# EAGLE design BpodMainBoard_r0_5_1 (EAGLE 9.1.1)
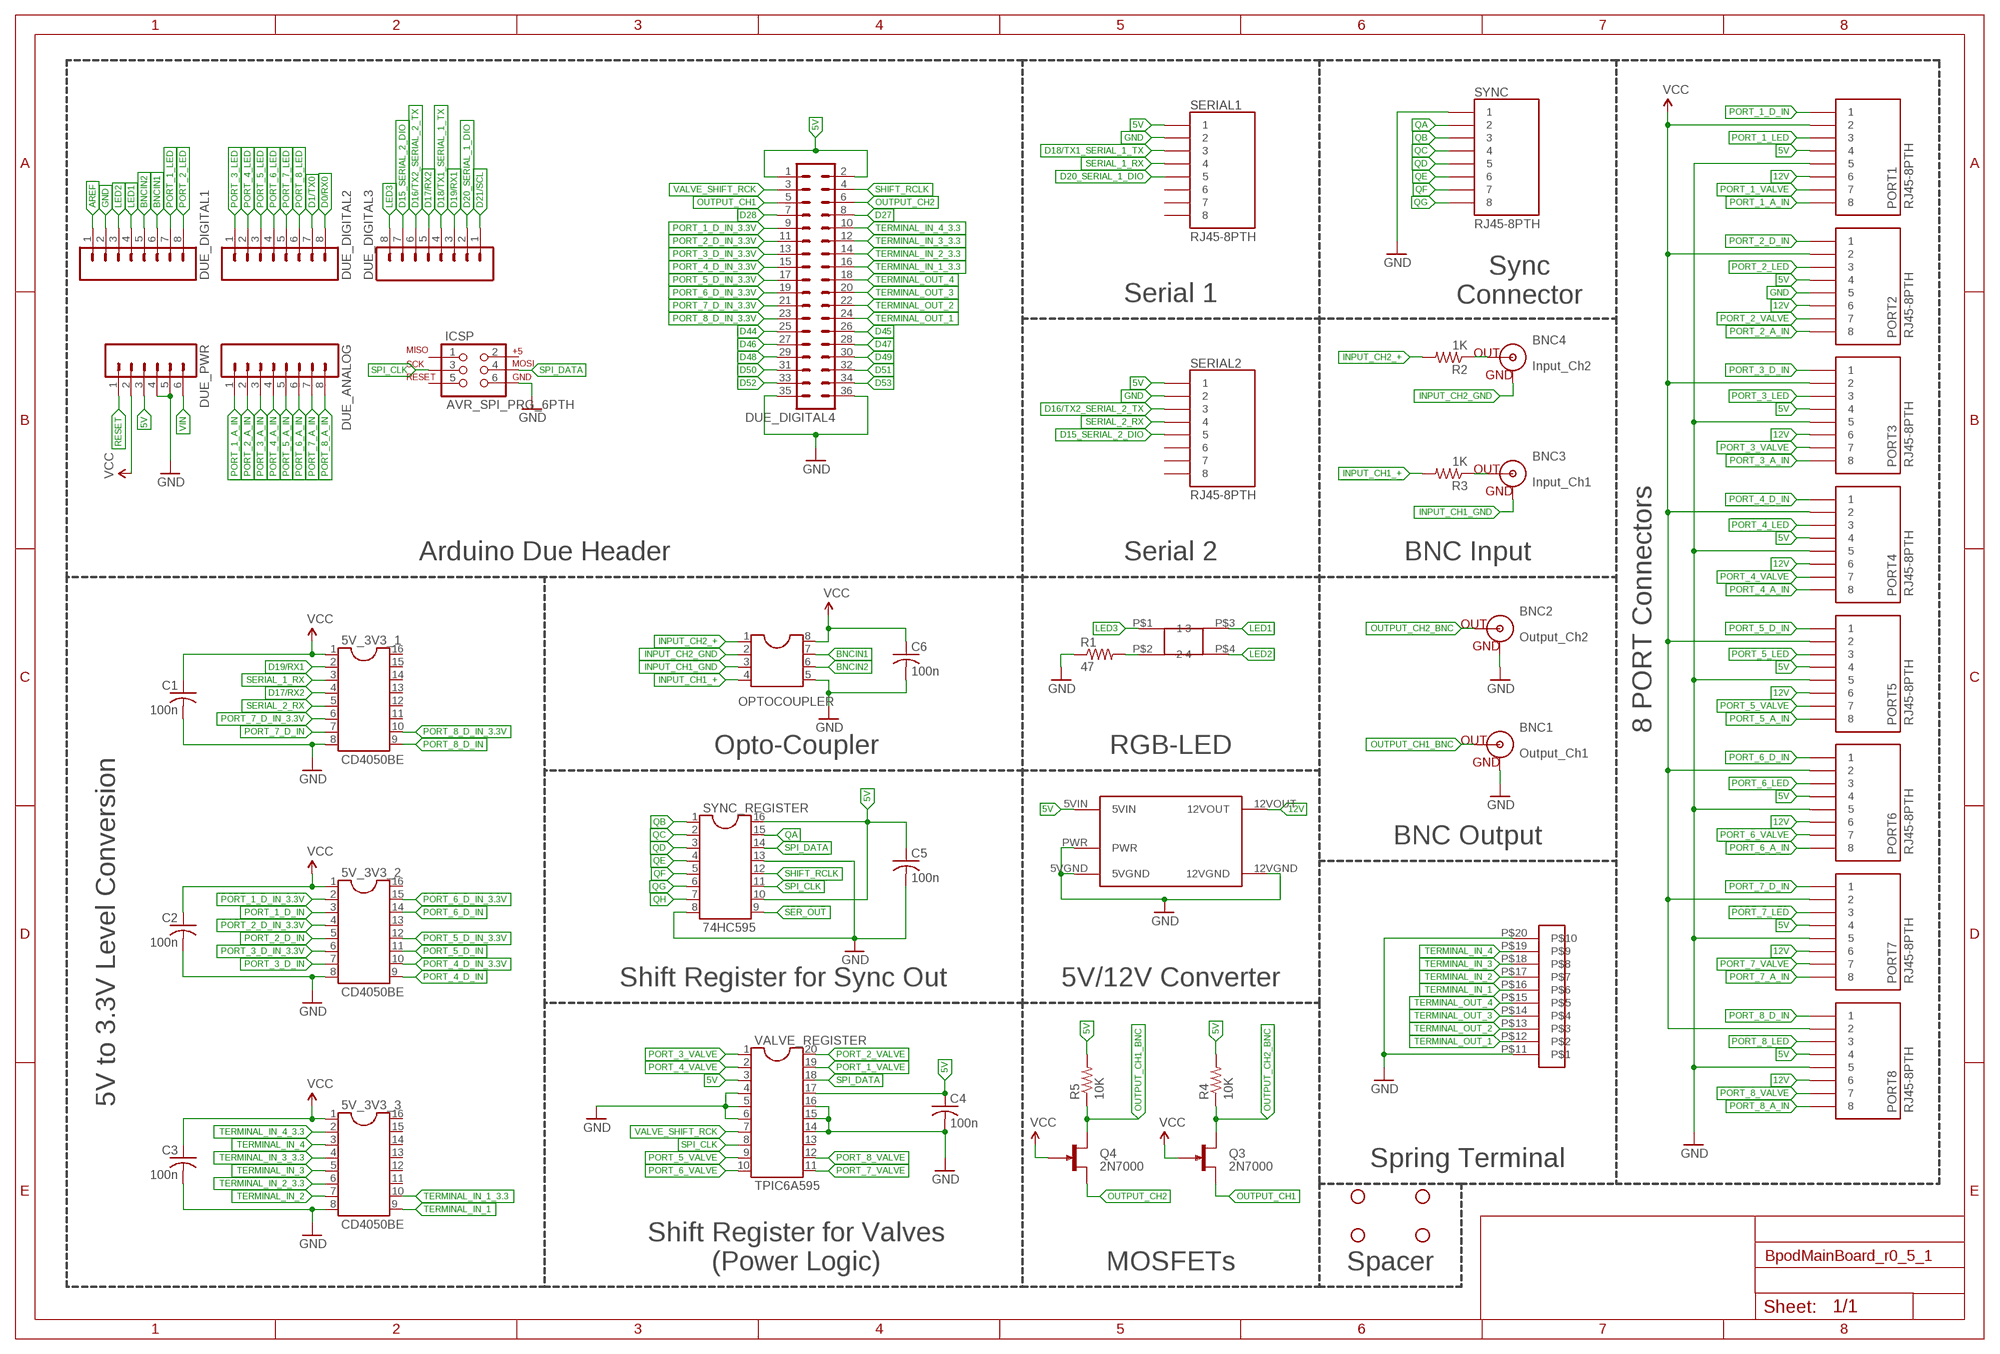
[diagram p0: schematic, sheet 1]

## Parts
5V_3V3_1  CD4050BE  DIL16  [DIL16]
5V_3V3_2  CD4050BE  DIL16  [DIL16]
5V_3V3_3  CD4050BE  DIL16  [DIL16]
BNC1  Output_Ch1  BNCPTH  [BNC]
BNC2  Output_Ch2  BNCPTH  [BNC]
BNC3  Input_Ch1  BNCPTH  [BNC]
BNC4  Input_Ch2  BNCPTH  [BNC]
C1  100n  C-US025-024X044  [C025-024X044]
C2  100n  C-US025-024X044  [C025-024X044]
C3  100n  C-US025-024X044  [C025-024X044]
C4  100n  C-US025-024X044  [C025-024X044]
C5  100n  C-US025-024X044  [C025-024X044]
C6  100n  C-US025-024X044  [C025-024X044]
DUE_ANALOG  M081X08  [1X08]
DUE_DIGITAL1  M081X08  [1X08]
DUE_DIGITAL2  M081X08  [1X08]
DUE_DIGITAL3  M081X08  [1X08]
DUE_DIGITAL4  MA18-2  [MA18-2]
DUE_PWR  M06SIP  [1X06]
ICSP  AVR_SPI_PRG_6PTH  [2X3]
JP1  STAND-OFF  [STAND-OFF]
JP2  STAND-OFF  [STAND-OFF]
JP3  STAND-OFF  [STAND-OFF]
JP4  STAND-OFF  [STAND-OFF]
OPTOCOUPLER  DIL8  [DIL08]
PORT1  RJ45-8PTH  [RJ45-8]
PORT2  RJ45-8PTH  [RJ45-8]
PORT3  RJ45-8PTH  [RJ45-8]
PORT4  RJ45-8PTH  [RJ45-8]
PORT5  RJ45-8PTH  [RJ45-8]
PORT6  RJ45-8PTH  [RJ45-8]
PORT7  RJ45-8PTH  [RJ45-8]
PORT8  RJ45-8PTH  [RJ45-8]
Q3  2N7000  2N3819  [TO92F]
Q4  2N7000  2N3819  [TO92F]
R1  47  R-US_0207/10  [0207/10]
R2  1K  R-US_0207/10  [0207/10]
R3  1K  R-US_0207/10  [0207/10]
R4  10K  R-US_0207/10  [0207/10]
R5  10K  R-US_0207/10  [0207/10]
SERIAL1  RJ45-8PTH  [RJ45-8]
SERIAL2  RJ45-8PTH  [RJ45-8]
SPRINGTERMINAL  10POS_SPRING_TERMINAL  [10POS_SCREW_TERMINAL]
SYNC  RJ45-8PTH  [RJ45-8]
SYNC_REGISTER  74HC595  DIL16  [DIL16]
U$5  TDK_LAMBDA_5V_TO_12V  [TDK_LAMBDA_5V_12V]
U$8  SQUARE_TRICOLOR_LED  [SQUARE_TRICOLOR_LED]
VALVE_REGISTER  TPIC6A595  DIL20  [DIL20]

## Nets
5V: C4.1 C5.1 DUE_DIGITAL4.1 DUE_DIGITAL4.2 DUE_PWR.3 PORT1.4 PORT2.4 PORT3.4 PORT4.4 PORT5.4 PORT6.4 PORT7.4 PORT8.4 R4.2 R5.2 SERIAL1.1 SERIAL2.1 SYNC_REGISTER.10 SYNC_REGISTER.16 U$5.5VIN VALVE_REGISTER.3 VALVE_REGISTER.17
12V: PORT1.6 PORT2.6 PORT3.6 PORT4.6 PORT5.6 PORT6.6 PORT7.6 PORT8.6 U$5.12VOUT
AREF: DUE_DIGITAL1.1
BNCIN1: DUE_DIGITAL1.6 OPTOCOUPLER.7
BNCIN2: DUE_DIGITAL1.5 OPTOCOUPLER.6
D0/RX0: DUE_DIGITAL2.8
D1/TX0: DUE_DIGITAL2.7
D15_SERIAL_2_DIO: DUE_DIGITAL3.7 SERIAL2.5
D16/TX2_SERIAL_2_TX: DUE_DIGITAL3.6 SERIAL2.3
D17/RX2: 5V_3V3_1.4 DUE_DIGITAL3.5
D18/TX1_SERIAL_1_TX: DUE_DIGITAL3.4 SERIAL1.3
D19/RX1: 5V_3V3_1.2 DUE_DIGITAL3.3
D20_SERIAL_1_DIO: DUE_DIGITAL3.2 SERIAL1.5
D21/SCL: DUE_DIGITAL3.1
D27: DUE_DIGITAL4.8
D28: DUE_DIGITAL4.7
D44: DUE_DIGITAL4.25
D45: DUE_DIGITAL4.26
D46: DUE_DIGITAL4.27
D47: DUE_DIGITAL4.28
D48: DUE_DIGITAL4.29
D49: DUE_DIGITAL4.30
D50: DUE_DIGITAL4.31
D51: DUE_DIGITAL4.32
D52: DUE_DIGITAL4.33
D53: DUE_DIGITAL4.34
GND: 5V_3V3_1.8 5V_3V3_2.8 5V_3V3_3.8 BNC1.GND BNC2.GND C1.2 C2.2 C3.2 C4.2 C5.2 C6.2 DUE_DIGITAL1.2 DUE_DIGITAL4.35 DUE_DIGITAL4.36 DUE_PWR.4 DUE_PWR.5 ICSP.6 OPTOCOUPLER.5 PORT1.5 PORT2.5 PORT3.5 PORT4.5 PORT5.5 PORT6.5 PORT7.5 PORT8.5 R1.1 SERIAL1.2 SERIAL2.2 SPRINGTERMINAL.P$11 SPRINGTERMINAL.P$20 SYNC.1 SYNC_REGISTER.8 SYNC_REGISTER.13 U$5.5VGND U$5.12VGND U$5.PWR VALVE_REGISTER.4 VALVE_REGISTER.5 VALVE_REGISTER.6 VALVE_REGISTER.14 VALVE_REGISTER.15 VALVE_REGISTER.16
INPUT_CH1_+: OPTOCOUPLER.4 R3.2
INPUT_CH1_GND: BNC3.GND OPTOCOUPLER.3
INPUT_CH2_+: OPTOCOUPLER.1 R2.2
INPUT_CH2_GND: BNC4.GND OPTOCOUPLER.2
INPUT_CH_1: BNC3.S(OUT) R3.1
INPUT_CH_2: BNC4.S(OUT) R2.1
LED1: DUE_DIGITAL1.4 U$8.P$3
LED2: DUE_DIGITAL1.3 U$8.P$4
LED3: DUE_DIGITAL3.8 U$8.P$1
LED_GND: R1.2 U$8.P$2
OUTPUT_CH1: DUE_DIGITAL4.5 Q3.S
OUTPUT_CH1_BNC: BNC1.S(OUT) Q4.D R5.1
OUTPUT_CH2: DUE_DIGITAL4.6 Q4.S
OUTPUT_CH2_BNC: BNC2.S(OUT) Q3.D R4.1
PORT_1_A_IN: DUE_ANALOG.1 PORT1.8
PORT_1_D_IN: 5V_3V3_2.3 PORT1.1
PORT_1_D_IN_3.3V: 5V_3V3_2.2 DUE_DIGITAL4.9
PORT_1_LED: DUE_DIGITAL1.7 PORT1.3
PORT_1_VALVE: PORT1.7 VALVE_REGISTER.19
PORT_2_A_IN: DUE_ANALOG.2 PORT2.8
PORT_2_D_IN: 5V_3V3_2.5 PORT2.1
PORT_2_D_IN_3.3V: 5V_3V3_2.4 DUE_DIGITAL4.11
PORT_2_LED: DUE_DIGITAL1.8 PORT2.3
PORT_2_VALVE: PORT2.7 VALVE_REGISTER.20
PORT_3_A_IN: DUE_ANALOG.3 PORT3.8
PORT_3_D_IN: 5V_3V3_2.7 PORT3.1
PORT_3_D_IN_3.3V: 5V_3V3_2.6 DUE_DIGITAL4.13
PORT_3_LED: DUE_DIGITAL2.1 PORT3.3
PORT_3_VALVE: PORT3.7 VALVE_REGISTER.1
PORT_4_A_IN: DUE_ANALOG.4 PORT4.8
PORT_4_D_IN: 5V_3V3_2.9 PORT4.1
PORT_4_D_IN_3.3V: 5V_3V3_2.10 DUE_DIGITAL4.15
PORT_4_LED: DUE_DIGITAL2.2 PORT4.3
PORT_4_VALVE: PORT4.7 VALVE_REGISTER.2
PORT_5_A_IN: DUE_ANALOG.5 PORT5.8
PORT_5_D_IN: 5V_3V3_2.11 PORT5.1
PORT_5_D_IN_3.3V: 5V_3V3_2.12 DUE_DIGITAL4.17
PORT_5_LED: DUE_DIGITAL2.3 PORT5.3
PORT_5_VALVE: PORT5.7 VALVE_REGISTER.9
PORT_6_A_IN: DUE_ANALOG.6 PORT6.8
PORT_6_D_IN: 5V_3V3_2.14 PORT6.1
PORT_6_D_IN_3.3V: 5V_3V3_2.15 DUE_DIGITAL4.19
PORT_6_LED: DUE_DIGITAL2.4 PORT6.3
PORT_6_VALVE: PORT6.7 VALVE_REGISTER.10
PORT_7_A_IN: DUE_ANALOG.7 PORT7.8
PORT_7_D_IN: 5V_3V3_1.7 PORT7.1
PORT_7_D_IN_3.3V: 5V_3V3_1.6 DUE_DIGITAL4.21
PORT_7_LED: DUE_DIGITAL2.5 PORT7.3
PORT_7_VALVE: PORT7.7 VALVE_REGISTER.11
PORT_8_A_IN: DUE_ANALOG.8 PORT8.8
PORT_8_D_IN: 5V_3V3_1.9 PORT8.1
PORT_8_D_IN_3.3V: 5V_3V3_1.10 DUE_DIGITAL4.23
PORT_8_LED: DUE_DIGITAL2.6 PORT8.3
PORT_8_VALVE: PORT8.7 VALVE_REGISTER.12
QA: SYNC.2 SYNC_REGISTER.15
QB: SYNC.3 SYNC_REGISTER.1
QC: SYNC.4 SYNC_REGISTER.2
QD: SYNC.5 SYNC_REGISTER.3
QE: SYNC.6 SYNC_REGISTER.4
QF: SYNC.7 SYNC_REGISTER.5
QG: SYNC.8 SYNC_REGISTER.6
QH: SYNC_REGISTER.7
RESET: DUE_PWR.1
SER_OUT: SYNC_REGISTER.9
SERIAL_1_RX: 5V_3V3_1.3 SERIAL1.4
SERIAL_2_RX: 5V_3V3_1.5 SERIAL2.4
SHIFT_RCLK: DUE_DIGITAL4.4 SYNC_REGISTER.12
SPI_CLK: ICSP.3 SYNC_REGISTER.11 VALVE_REGISTER.8
SPI_DATA: ICSP.4 SYNC_REGISTER.14 VALVE_REGISTER.18
TERMINAL_IN_1: 5V_3V3_3.9 SPRINGTERMINAL.P$16
TERMINAL_IN_1_3.3: 5V_3V3_3.10 DUE_DIGITAL4.16
TERMINAL_IN_2: 5V_3V3_3.7 SPRINGTERMINAL.P$17
TERMINAL_IN_2_3.3: 5V_3V3_3.6 DUE_DIGITAL4.14
TERMINAL_IN_3: 5V_3V3_3.5 SPRINGTERMINAL.P$18
TERMINAL_IN_3_3.3: 5V_3V3_3.4 DUE_DIGITAL4.12
TERMINAL_IN_4: 5V_3V3_3.3 SPRINGTERMINAL.P$19
TERMINAL_IN_4_3.3: 5V_3V3_3.2 DUE_DIGITAL4.10
TERMINAL_OUT_1: DUE_DIGITAL4.24 SPRINGTERMINAL.P$12
TERMINAL_OUT_2: DUE_DIGITAL4.22 SPRINGTERMINAL.P$13
TERMINAL_OUT_3: DUE_DIGITAL4.20 SPRINGTERMINAL.P$14
TERMINAL_OUT_4: DUE_DIGITAL4.18 SPRINGTERMINAL.P$15
VALVE_SHIFT_RCK: DUE_DIGITAL4.3 VALVE_REGISTER.7
VCC: 5V_3V3_1.1 5V_3V3_2.1 5V_3V3_3.1 C1.1 C2.1 C3.1 C6.1 DUE_PWR.2 OPTOCOUPLER.8 PORT1.2 PORT2.2 PORT3.2 PORT4.2 PORT5.2 PORT6.2 PORT7.2 PORT8.2 Q3.G Q4.G
VIN: DUE_PWR.6
Unconnected: 5V_3V3_1.11 5V_3V3_1.12 5V_3V3_1.13 5V_3V3_1.14 5V_3V3_1.15 5V_3V3_1.16 5V_3V3_2.13 5V_3V3_2.16 5V_3V3_3.11 5V_3V3_3.12 5V_3V3_3.13 5V_3V3_3.14 5V_3V3_3.15 5V_3V3_3.16 ICSP.1 ICSP.2 ICSP.5 SERIAL1.6 SERIAL1.7 SERIAL1.8 SERIAL2.6 SERIAL2.7 SERIAL2.8 VALVE_REGISTER.13

## Notes on the sheet
- Sync
  Connector
- Serial 1
- Arduino Due Header | Serial 2 | BNC Input
- 8 PORT Connectors
- Opto-Coupler | RGB-LED
- BNC Output
- 5V to 3.3V Level Conversion
- Shift Register for Sync Out | 5V/12V Converter
- Spring Terminal
- Shift Register for Valves
  (Power Logic)
- MOSFETs | Spacer

## Library data of the parts
5V_3V3_1-5V_3V3_3 SYNC_REGISTER = ic-package:DIL16: Dual In Line / Socket
BNC1-BNC4 = SparkFun:BNC: BNC Connector, Mouser Part# 5227161
C1-C6 = rcl:C-US: CAPACITOR, American symbol; SPICEPREFIX: C
DUE_ANALOG DUE_DIGITAL1-DUE_DIGITAL3 = SparkFun:M08: Header 8 Standard 8-pin 0.1" header. Use with straight break away headers (SKU : PRT-00116), right angle break away headers (PRT-00553), swiss pins (PRT-00743), machine pins (PRT-00117), and female headers (PRT-00115).
DUE_DIGITAL4 = con-lstb:MA18-2: PIN HEADER
DUE_PWR = SparkFun:M06: Header 6 Standard 6-pin 0.1" header. Use with straight break away headers (SKU : PRT-00116), right angle break away headers (PRT-00553), swiss pins (PRT-00743), machine pins (PRT-00117), and female headers (PRT-00115). Molex polarized connector foot print use with SKU : PRT-08094 with associated crimp pins and housings. NOTES ON THE VARIANTS LOCK and LOCK_LONGPADS... This footprint was designed to help hold the alignment of a through-hole component (i.e. 6-pin header) while soldering it into place. You may notice that each hole has been shifted either up or down by 0.005 of an inch from it's more standard position (which is a perfectly straight line). This slight alteration caused the pins (the squares in the middle) to touch the edges of the holes. Because they are alternating, it causes a "brace" to hold the component in place. 0.005 has proven to be the perfect amount of "off-center" position when using our standard breakaway headers. Although looks a little odd when you look at the bare footprint, once you have a header in there, the alteration is very hard to notice. Also, if you push a header all the way into place, it is covered up entirely on the bottom side. This idea of altering the position of holes to aid alignment will be further integrated into the Sparkfun Library for other footprints. It can help hold any component with 3 or more connection pins.; SPICEPREFIX: X
ICSP = SparkFun:AVR_SPI_PRG_6: AVR ISP 6 Pin This is the reduced ISP connector for AVR programming. Common on Arduino. This footprint will take up less PCB space and can be used with a 10-pin to 6-pin adapter such as SKU: BOB-08508
JP1-JP4 = SparkFun:STAND-OFF: Stand Off This is the mechanical footprint for a #4 phillips button head screw. Use the keepout ring to avoid running the screw head into surrounding components. SKU : PRT-00447
OPTOCOUPLER = ic-package:DIL8: Dual In Line / Socket
PORT1-PORT8 SERIAL1 SERIAL2 SYNC = SparkFun:RJ45-8: RJ45 Jack Simple RJ45, 8-pin connection - connector for common Cat5, Cat5e, and Cat6 Ethernet cables. Footprint not yet proven in production. Connector sku is PRT-00643; Breakout PCB sku is BOB-00716.
Q3 Q4 = transistor-small-signal:2N3819: N-CHANNEL FET
R1-R5 = rcl:R-US_: RESISTOR, American symbol; SPICEPREFIX: R
SPRINGTERMINAL = JoshParts:10POS_SPRING_TERMINAL
U$5 = JoshParts:TDK_LAMBDA_5V_TO_12V
U$8 = JoshParts:SQUARE_TRICOLOR_LED
VALVE_REGISTER = ic-package:DIL20: Dual In Line / Socket

## Net classes
0 default: width 0.254 mm, clearance 0.254 mm

## Board
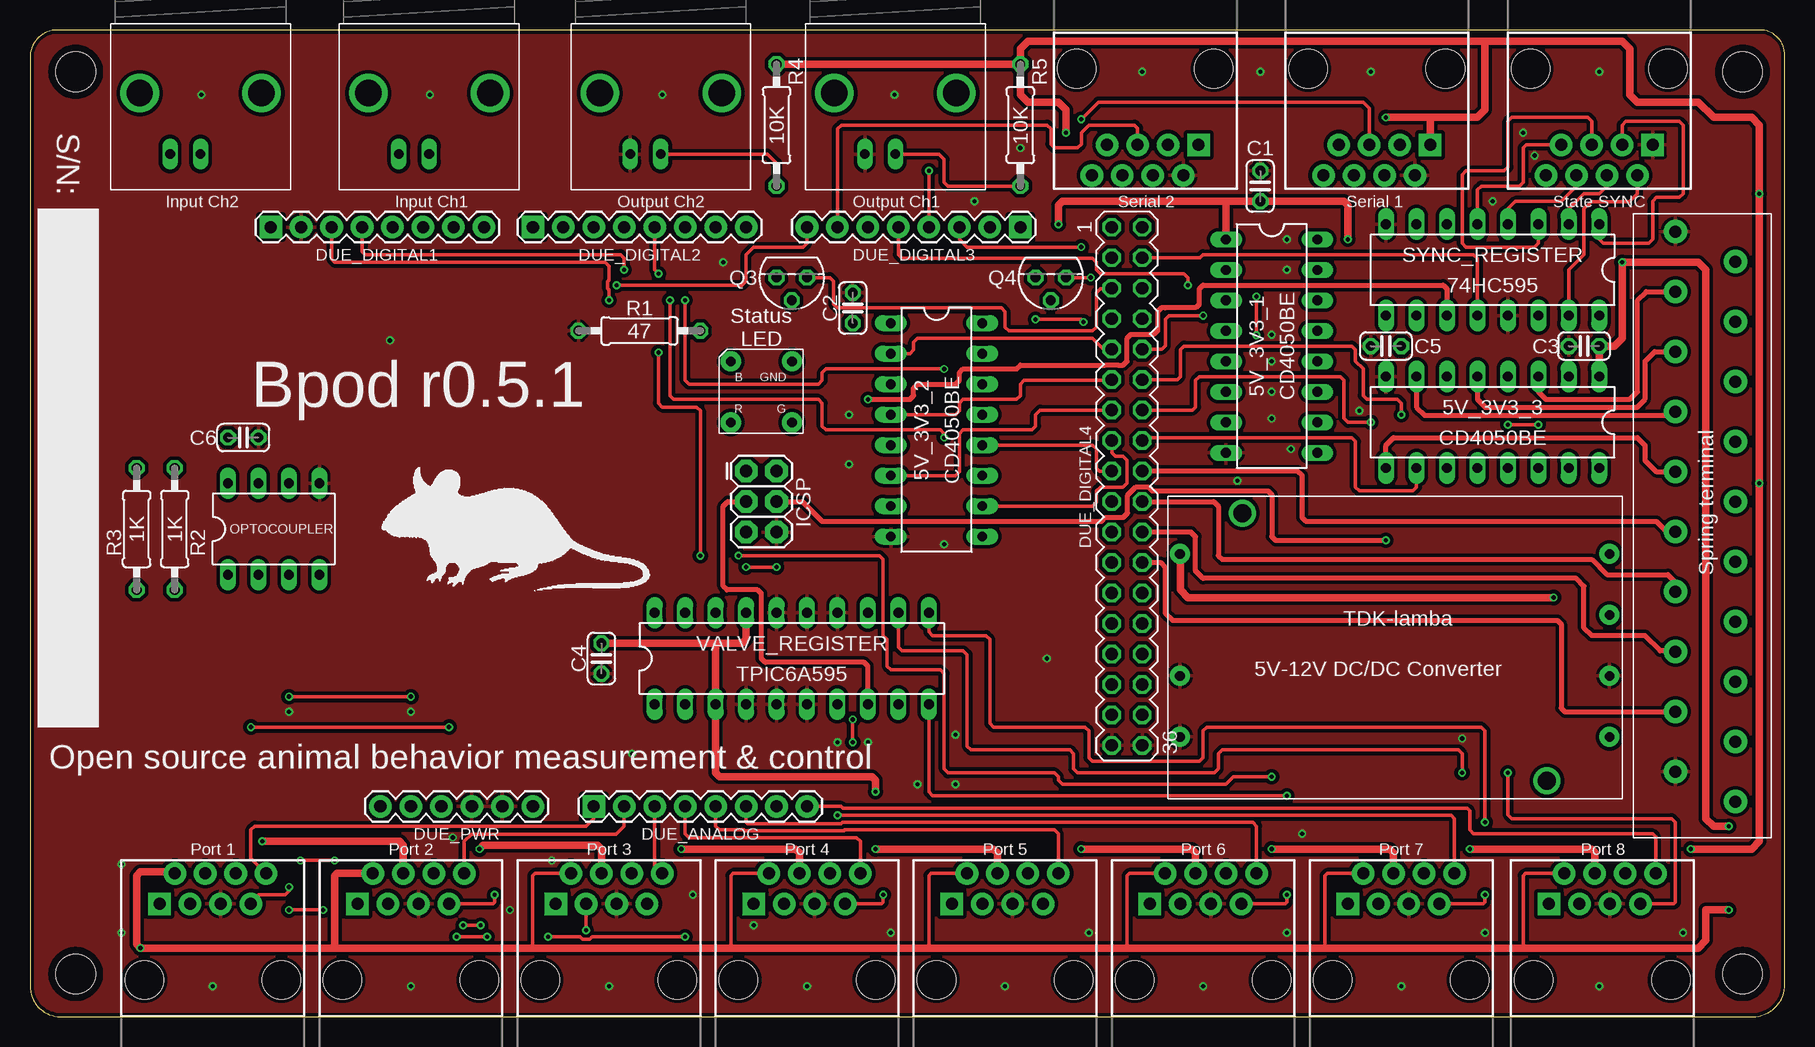
[diagram p1: board, top side]
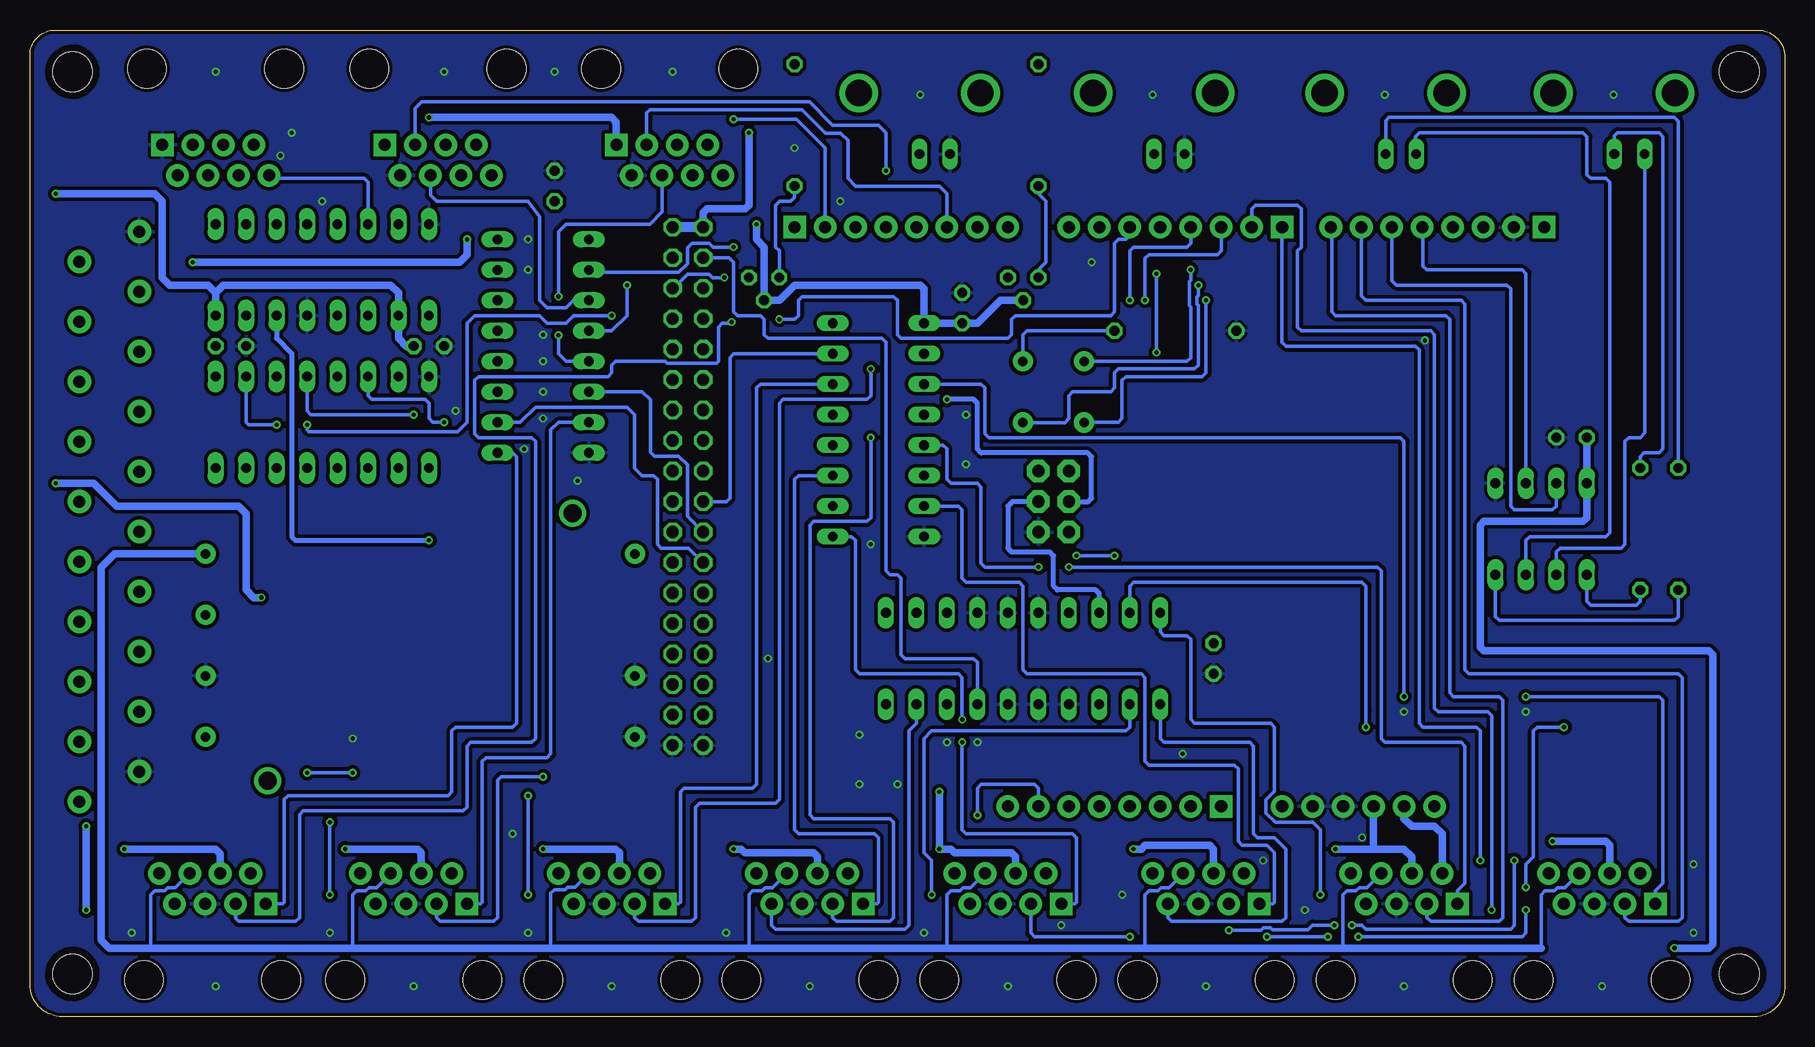
[diagram p2: board, bottom side, seen from below]

Size 146.28 x 82.22 mm. Coordinates in mm from the lower left corner, seen from the top.
Outline: 143.6,0 arc90 146.28,2.69 146.28,80.13 arc90 144.2,82.22 2.28,82.22 arc90 0,79.94 0,2.54 arc90 2.54,0 143.6,0
Copper layers (1*16): Top 0.035mm / dielectric 1.5mm / Bottom 0.035mm
Design rules "SeeedStudio_2layer_DRU_no_angle_20140221": minimum track width 6mil, minimum drill 12mil, track to track 6mil, track to pad 6mil, pad to pad 6mil, via to via 6mil, smd to smd 0mil, copper to edge 10mil, drill to drill 10mil, minimum pad ring 10mil, minimum via ring 6mil, stop-mask expansion 2mil, vias tented up to drill 100mil, thermal gap 10mil

### Footprints (pad centres in the part's own frame; a part is rotated, then mirrored left to right if it is on the bottom)
DIL16 = drill 0.813 long: 1 -8.89,-3.81; 2 -6.35,-3.81; 3 -3.81,-3.81; 4 -1.27,-3.81; 5 1.27,-3.81; 6 3.81,-3.81; 7 6.35,-3.81; 8 8.89,-3.81; 9 8.89,3.81; 10 6.35,3.81; 11 3.81,3.81; 12 1.27,3.81; 13 -1.27,3.81; 14 -3.81,3.81; 15 -6.35,3.81; 16 -8.89,3.81
BNC = drill 2.2: 3 -5.08,5.08; 4 5.08,5.08 | drill 0.8 long: GND -2.54,0; S 0,0
C025-024X044 = drill 0.813 octagon: 1 -1.27,0; 2 1.27,0
1X08 = drill 1.016 pad 1.88 square: 1 0,0 | drill 1.016 pad 1.88: 2 2.54,0; 3 5.08,0; 4 7.62,0; 5 10.16,0; 6 12.7,0; 7 15.24,0; 8 17.78,0
MA18-2 = drill 1.016 octagon: 1 -21.59,-1.27; 2 -21.59,1.27; 3 -19.05,-1.27; 4 -19.05,1.27; 5 -16.51,-1.27; 6 -16.51,1.27; 7 -13.97,-1.27; 8 -13.97,1.27; 9 -11.43,-1.27; 10 -11.43,1.27; 11 -8.89,-1.27; 12 -8.89,1.27; 13 -6.35,-1.27; 14 -6.35,1.27; 15 -3.81,-1.27; 16 -3.81,1.27; 17 -1.27,-1.27; 18 -1.27,1.27; 19 1.27,-1.27; 20 1.27,1.27; 21 3.81,-1.27; 22 3.81,1.27; 23 6.35,-1.27; 24 6.35,1.27; 25 8.89,-1.27; 26 8.89,1.27; 27 11.43,-1.27; 28 11.43,1.27; 29 13.97,-1.27; 30 13.97,1.27; 31 16.51,-1.27; 32 16.51,1.27; 33 19.05,-1.27; 34 19.05,1.27; 35 21.59,-1.27; 36 21.59,1.27
1X06 = drill 1.016 pad 1.88: 1 0,0; 2 2.54,0; 3 5.08,0; 4 7.62,0; 5 10.16,0; 6 12.7,0
2X3 = drill 1.016 pad 1.88 octagon: 1 0,0; 2 0,2.54; 3 2.54,0; 4 2.54,2.54; 5 5.08,0; 6 5.08,2.54
STAND-OFF = hole 3.302: 0,0
DIL08 = drill 0.813 long: 1 -3.81,-3.81; 2 -1.27,-3.81; 3 1.27,-3.81; 4 3.81,-3.81; 5 3.81,3.81; 6 1.27,3.81; 7 -1.27,3.81; 8 -3.81,3.81
RJ45-8 = drill 1 pad 1.88 square: 1 -4.445,6.35 | drill 1 pad 1.88: 2 -3.175,8.89; 3 -1.905,6.35; 4 -0.635,8.89; 5 0.635,6.35; 6 1.905,8.89; 7 3.175,6.35; 8 4.445,8.89 | hole 3.2: -5.715,0; 5.715,0
TO92F = drill 0.813 octagon: D 1.27,0; G 0,1.905; S -1.27,0
0207/10 = drill 0.813 octagon: 1 -5.08,0; 2 5.08,0
10POS_SCREW_TERMINAL = drill 1 pad 1.93: P$1 -10,-5; P$2 -5,-5; P$3 0,-5; P$4 5,-5; P$5 10,-5; P$6 -15,-5; P$7 15,-5; P$8 -20,-5; P$9 20,-5; P$10 -25,-5; P$11 -22.5,0; P$12 -17.5,0; P$13 -12.5,0; P$14 -7.5,0; P$15 -2.5,0; P$16 2.5,0; P$17 7.5,0; P$18 12.5,0; P$19 17.5,0; P$20 22.5,0
TDK_LAMBDA_5V_12V = drill 0.8 pad 1.676: 5VGND -6,-12.24; 5VIN -6,3; 12VGND 29.8,-7.16; 12VOUT 29.8,3; P$4 29.8,-12.24; P$6 29.8,-2.08; PWR -6,-7.16 | drill 1.5: P$8 -0.8,6.4; P$9 24.6,-15.92
SQUARE_TRICOLOR_LED = drill 0.8 pad 1.676: P$1 -5.1,5.1; P$2 -5.1,0; P$3 0,0; P$4 0,5.1
DIL20 = drill 0.813 long: 1 -11.43,-3.81; 2 -8.89,-3.81; 3 -6.35,-3.81; 4 -3.81,-3.81; 5 -1.27,-3.81; 6 1.27,-3.81; 7 3.81,-3.81; 8 6.35,-3.81; 9 8.89,-3.81; 10 11.43,-3.81; 11 11.43,3.81; 12 8.89,3.81; 13 6.35,3.81; 14 3.81,3.81; 15 1.27,3.81; 16 -1.27,3.81; 17 -3.81,3.81; 18 -6.35,3.81; 19 -8.89,3.81; 20 -11.43,3.81

### Placement (x,y rotation side)
5V_3V3_1  103.5,55.88 270 top
5V_3V3_2  75.56,48.9 270 top
5V_3V3_3  121.92,49.53 180 top
BNC1  72.14,71.88 0 top
BNC2  52.58,71.88 0 top
BNC3  33.27,71.88 0 top
BNC4  14.22,71.88 0 top
C1  102.55,69.22 90 top
C2  68.58,59.05 90 top
C3  129.54,55.88 180 top
C4  47.62,29.84 270 top
C5  113.03,55.88 180 top
C6  17.78,48.26 0 top
DUE_ANALOG  46.99,17.53 0 top
DUE_DIGITAL1  20.07,65.79 0 top
DUE_DIGITAL2  41.91,65.79 0 top
DUE_DIGITAL3  82.55,65.79 180 top
DUE_DIGITAL4  91.44,44.2 270 top
DUE_PWR  29.21,17.53 0 top
ICSP  59.69,45.47 270 top
JP1  3.81,78.74 0 top
JP2  3.81,3.56 0 top
JP3  142.75,3.56 0 top
JP4  142.75,78.74 0 top
OPTOCOUPLER  20.32,40.64 0 top
PORT1  15.24,3.05 0 top
PORT2  31.75,3.05 0 top
PORT3  48.26,3.05 0 top
PORT4  64.77,3.05 0 top
PORT5  81.28,3.05 0 top
PORT6  97.79,3.05 0 top
PORT7  114.3,3.05 0 top
PORT8  131.06,3.05 0 top
Q3  63.5,61.59 180 top
Q4  85.09,61.59 180 top
R1  50.8,57.15 0 top
R2  12.06,40.64 270 top
R3  8.89,40.64 270 top
R4  62.23,74.3 90 top
R5  82.55,74.3 90 top
SERIAL1  112.27,78.99 180 top
SERIAL2  92.96,78.99 180 top
SPRINGTERMINAL  137.16,42.93 90 top
SYNC  130.81,78.99 180 top
SYNC_REGISTER  121.92,62.23 180 top
U$5  101.85,35.56 0 top
U$7  [MOUSELOGO]  27.37,47.62 270 top
U$8  58.42,54.61 180 top
VALVE_REGISTER  63.5,29.84 0 top

### Tracks (layer width: path | path; a pad name or v marks a point on that pad's centre or on a via)
5V  (via drill 0.35)
  Top 0.61: R4.2 R5.2 | 121.28,81.28 83.19,81.28 82.55,80.64 R5.2 | v86.36,73.66 86.36,75.56 85.72,76.2 83.19,76.2 82.55,76.83 R5.2 | v113.03,74.93 116.84,74.93 | 116.84,74.93 120.65,74.93 121.28,75.56 121.28,81.28 | SERIAL1.1 116.71,74.8 116.84,74.93 | 121.28,81.28 132.72,81.28 133.35,80.64 133.35,76.83 133.99,76.2 139.06,76.2 140.34,74.93 143.51,74.93 144.15,74.3 v144.15,68.58 v144.15,44.45 144.15,14.61 143.51,13.97 v138.43,13.97 | U$5.5VIN 95.89,38.53 95.89,35.56 96.52,34.92 v127,34.92 | PORT8.4 130.43,13.72 130.18,13.97 v120.02,13.97 | PORT7.4 113.67,13.65 113.35,13.97 v103.5,13.97 | PORT6.4 97.16,13.65 96.84,13.97 v87.63,13.97 | v70.48,13.97 80.33,13.97 80.64,13.65 PORT5.4 | v54.29,13.97 63.82,13.97 64.14,13.65 PORT4.4 | PORT3.4 47.62,13.97 47.31,14.29 37.78,14.29 v37.47,13.97 | v70.48,18.73 70.48,19.68 70.17,20 57.47,20 57.15,20.32 VALVE_REGISTER.3 57.15,31.11 | VALVE_REGISTER.17 59.69,31.43 59.37,31.11 57.15,31.11 | C4.1 57.15,31.11 | v19.37,14.61 30.8,14.61 31.11,14.29 PORT2.4
  Bottom 0.61: PORT2.4 31.11,13.34 31.75,13.97 34.29,13.97 | 130.81,60.33 130.18,60.96 116.2,60.96 115.57,60.33 SYNC_REGISTER.10 115.57,56.52 114.94,55.88 C5.1 | SYNC_REGISTER.16 130.81,60.33 | 130.81,60.33 131.44,60.96 134.62,60.96 135.25,61.59 135.25,67.94 135.89,68.58 v144.15,68.58 | SERIAL2.1 97.41,74.55 97.79,74.93 v113.03,74.93 | v127,34.92 127.64,34.92 128.27,35.56 128.27,41.91 128.91,42.55 139.06,42.55 140.97,44.45 v144.15,44.45 | DUE_DIGITAL4.1 90.17,66.99 89.85,67.31 86.68,67.31 86.36,67.63 v86.36,73.66 | v138.43,13.97 130.81,13.97 130.43,13.59 PORT8.4 | v120.02,13.97 113.98,13.97 113.67,13.65 PORT7.4 | v103.5,13.97 97.47,13.97 97.16,13.65 PORT6.4 | PORT3.4 47.62,13.97 47.94,14.29 53.34,14.29 53.66,13.97 v54.29,13.97 | v37.47,13.97 34.29,13.97 | DUE_PWR.3 34.29,13.97 | v70.48,18.73 v70.48,13.97 69.53,13.97 69.22,13.65 64.45,13.65 64.14,13.34 PORT4.4 | v19.37,14.61 14.92,14.61 14.61,14.29 PORT1.4 | v87.63,13.97 87,13.97 86.68,13.65 80.96,13.65 80.64,13.34 PORT5.4
  Bottom 0.813: DUE_DIGITAL4.1 DUE_DIGITAL4.2
12V
  Bottom 0.305: PORT7.6 117.4,10.74 118.03,10.74 118.3,10.48 119.06,10.48 119.38,10.16 119.38,5.71 | PORT6.6 100.84,10.79 101.47,10.79 101.68,10.59 102.55,10.59 102.87,10.27 102.87,5.71 | PORT8.6 134.16,10.74 134.8,10.74 135.06,10.48 135.89,10.48 136.21,10.16 136.21,5.71 | PORT5.6 84.38,10.74 85.01,10.74 85.28,10.48 86.04,10.48 86.36,10.16 86.36,5.71 | PORT4.6 67.87,10.74 68.5,10.74 68.77,10.48 69.53,10.48 69.85,10.16 69.85,5.71 | PORT3.6 51.36,10.74 51.99,10.74 52.26,10.48 53.02,10.48 53.34,10.16 53.34,5.71 | PORT2.6 34.85,10.74 35.48,10.74 35.75,10.48 36.51,10.48 36.83,10.16 36.83,5.71 | PORT1.6 18.34,10.74 18.97,10.74 19.24,10.48 20,10.48 20.32,10.16 20.32,5.71
  Bottom 0.61: U$5.12VOUT 139.24,38.56 140.34,37.47 140.34,10.48 140.34,6.35 139.7,5.71 136.21,5.71 119.38,5.71 102.87,5.71 86.36,5.71 69.85,5.71 53.34,5.71 36.83,5.71 20.32,5.71
BNCIN1
  Bottom 0.305: DUE_DIGITAL1.6 32.77,61.34 32.38,60.96 23.18,60.96 22.86,60.64 22.86,42.55 22.54,42.23 19.37,42.23 19.05,42.55 OPTOCOUPLER.7
BNCIN2
  Bottom 0.305: OPTOCOUPLER.6 21.59,61.91 21.91,62.23 29.84,62.23 30.16,62.55 30.16,65.72 DUE_DIGITAL1.5
D15_SERIAL_2_DIO
  Top 0.305: DUE_DIGITAL3.7 67.31,73.98 67.63,74.3 84.77,74.3 85.09,73.98 85.09,72.71 85.41,72.39 87.31,72.39 87.63,72.71 87.63,73.66 88.27,74.3 92.08,74.3 92.33,74.04 SERIAL2.5
D16/TX2_SERIAL_2_TX
  Bottom 0.305: DUE_DIGITAL3.6 69.85,68.58 70.48,69.22 77.47,69.22 78.11,69.85 78.11,73.03 78.72,73.64 78.74,73.64 79.98,73.64 81.92,75.56 94.61,75.56 94.87,75.31 SERIAL2.3
D17/RX2  (via drill 0.35)
  Top 0.305: DUE_DIGITAL3.5 72.39,63.5 72.71,63.18 88.58,63.18 88.9,62.87 88.9,62.23 89.22,61.91 96.2,61.91 96.52,61.59 v96.52,60.96
  Bottom 0.305: 5V_3V3_1.4 97.79,57.15 96.52,58.42 v96.52,60.96
D18/TX1_SERIAL_1_TX  (via drill 0.35)
  Top 0.305: v74.93,70.48 DUE_DIGITAL3.4
  Bottom 0.305: v74.93,70.48 74.93,73.66 75.56,74.3 79.38,74.3 81.31,76.22 113.64,76.22 114.17,75.69 SERIAL1.3
D19/RX1  (via drill 0.35)
  Top 0.305: v87.63,64.14 78.11,64.14 77.47,64.77 DUE_DIGITAL3.3
  Bottom 0.305: v87.63,64.14 89.33,64.14 89.67,64.47 91.11,64.47 91.49,64.08 91.49,62.74 92.2,62.03 92.71,62.03 93.22,62.03 98.54,62.03 98.74,62.23 5V_3V3_1.2
D20_SERIAL_1_DIO  (via drill 0.35)
  Top 0.305: SERIAL1.5 111.63,75.69 111.12,76.2 89.05,76.2 v87.63,74.78
  Bottom 0.305: DUE_DIGITAL3.2 80.01,72.39 82.4,74.78 v87.63,74.78
GND  (via drill 0.35)
  other vias: 7.62,12.7 130.81,2.54 114.3,2.54 97.79,2.54 81.28,2.54 64.77,2.54 48.26,2.54 31.75,2.54 15.24,2.54 35.24,14.92 88.27,6.99 104.78,6.99 121.28,6.99 137.79,6.99 71.75,6.99 92.71,78.74 111.76,78.74 130.81,78.74 68.26,46.04 7.62,6.99 21.59,25.4 31.75,25.4 55.24,10.16 73.98,19.37 67.31,22.86 69.85,22.86 60.33,7.62 40.01,8.89 102.55,78.74 104.78,62.23 72.07,76.83 43.5,13.02 100.65,44.65 103.5,49.85 103.5,52.07 103.5,56.83 84.77,29.84 77.15,23.5 106.05,15.24 30.01,56.35 50.2,21.9 119.38,23.18 77.15,19.37 105.09,47.31 103.5,54.61 110.81,50.48 124.46,73.66 125.41,71.75 121.92,67.94 76.2,39.37 82.55,72.39 78.74,67.94 68.26,50.16 57.78,62.87 104.78,64.77 52.7,76.83 33.34,76.83 14.29,76.83
  pour Bottom (isolate 0.305): 0,2.54 arc90 2.54,0 143.76,0 arc90 146.3,2.54 146.3,80.01 arc90 144.15,82.17 2.16,82.17 arc90 0,80.01
  pour Top (isolate 0.305): 0,2.54 arc90 2.54,0 143.51,0 143.64,0 arc90 146.3,2.67 146.3,80.01 arc90 144.15,82.17 2.16,82.17 arc90 0,80.01
INPUT_CH1_+
  Bottom 0.305: R3.2 8.89,33.34 9.21,33.02 23.81,33.02 24.13,33.34 OPTOCOUPLER.4
INPUT_CH1_GND
  Bottom 0.305: BNC3.GND 30.8,71.94 30.8,73.34 30.48,73.66 16.83,73.66 16.51,73.34 16.51,70.17 16.19,69.85 14.92,69.85 14.61,69.53 14.61,40.32 14.92,40.01 21.27,40.01 21.59,39.69 OPTOCOUPLER.3
INPUT_CH2_+
  Bottom 0.305: R2.2 12.06,34.61 12.38,34.29 16.19,34.29 16.51,34.61 OPTOCOUPLER.1
INPUT_CH2_GND
  Bottom 0.305: OPTOCOUPLER.2 19.05,38.73 18.73,39.05 13.65,39.05 13.34,39.37 13.34,47.94 13.02,48.26 12.06,48.26 11.68,48.64 BNC4.GND
INPUT_CH_1
  Bottom 0.305: BNC3.S 33.27,74.68 33.02,74.93 9.21,74.93 8.89,74.61 R3.1
INPUT_CH_2
  Bottom 0.305: BNC4.S 14.22,73.41 13.97,73.66 10.48,73.66 10.16,73.34 10.16,47.31 10.48,46.99 11.75,46.99 12.06,46.67 R2.1
LED1  (via drill 0.35)
  Top 0.305: DUE_DIGITAL1.4 27.69,63.75 27.94,63.5 49.21,63.5 49.53,63.18 v49.53,62.23
  Bottom 0.305: U$8.P$3 49.85,54.61 49.53,54.93 49.53,59.13 49.63,59.23 49.63,61.26 49.53,61.36 v49.53,62.23
LED2  (via drill 0.35)
  Top 0.305: DUE_DIGITAL1.3 25.15,63.12 25.4,62.87 47.94,62.87 48.26,62.55 48.26,61.36 48.16,61.26 48.16,60.66 48.26,60.56 v48.26,59.69
  Bottom 0.305: U$8.P$4 58.4,49.53 55.56,49.53 55.24,49.85 55.24,53.02 54.93,53.34 48.58,53.34 48.26,53.66 v48.26,59.69
LED3  (via drill 0.35)
  Top 0.305: v48.9,60.96 59.37,60.96 59.69,61.28 59.69,63.5 60.33,64.14 64.45,64.14 64.77,64.45 DUE_DIGITAL3.8
  Bottom 0.305: U$8.P$1 60.03,49.51 59.69,49.85 59.69,51.75 59.37,52.07 56.2,52.07 55.88,52.39 55.88,53.66 55.56,53.98 49.21,53.98 48.9,54.29 48.9,59.29 48.99,59.39 48.99,59.99 48.9,60.09 v48.9,60.96
LED_GND
  Bottom 0.305: U$8.P$2 63.5,54.63 63.5,56.83 63.18,57.15 R1.2
OUTPUT_CH1
  Top 0.305: Q3.S 66.67,61.59 66.99,61.28 66.99,59.37 67.31,59.05 80.96,59.05 81.28,58.74 81.28,57.47 81.6,57.15 88.58,57.15 88.9,57.47 88.9,60.33 89.22,60.64 90.11,60.64 DUE_DIGITAL4.5
OUTPUT_CH1_BNC
  Top 0.305: R5.1 76.52,69.22 76.2,69.53 76.2,71.44 75.75,71.88 BNC1.S
  Bottom 0.305: R5.1 82.55,68.26 82.87,67.94 83.82,67.94 84.14,67.63 84.14,64.14 83.82,63.82 Q4.D
OUTPUT_CH2  (via drill 0.35)
  Top 0.305: Q4.S v88.42,61.59
  Bottom 0.305: v88.42,61.59 88.9,61.59 89.33,61.59 89.41,61.59 89.69,61.87 91.48,61.87 92.65,60.71 DUE_DIGITAL4.6
OUTPUT_CH2_BNC
  Top 0.305: BNC2.S 61.47,71.88 62.23,71.12 R4.1
  Bottom 0.305: Q3.D 62.23,62.23 61.59,62.87 61.59,67.94 62.23,68.58 R4.1
PORT_1_A_IN
  Top 0.305: DUE_ANALOG.1 46.99,16.51 46.35,15.88 18.73,15.88 18.41,15.56 18.41,13.21 PORT1.8
PORT_1_D_IN  (via drill 0.35)
  Top 0.305: v21.59,26.67 v31.75,26.67
  Bottom 0.305: 5V_3V3_2.3 66.99,52.7 66.67,52.39 66.67,48.58 66.36,48.26 32.07,48.26 31.75,47.94 v31.75,26.67 | PORT1.1 10.79,10.48 10.16,11.11 10.16,26.35 10.48,26.67 v21.59,26.67
PORT_1_D_IN_3.3V
  Top 0.305: 5V_3V3_2.2 73.34,55.24 73.66,55.56 73.66,56.2 73.98,56.52 88.58,56.52 89.47,55.63 DUE_DIGITAL4.9
PORT_1_LED
  Bottom 0.305: DUE_DIGITAL1.7 35.31,60.07 34.92,59.69 26.99,59.69 26.67,59.37 26.67,28.89 26.35,28.57 8.89,28.57 8.57,28.26 8.57,8.26 8.89,7.94 13.02,7.94 13.34,8.26 PORT1.3
PORT_1_VALVE  (via drill 0.35)
  Top 0.305: v18.41,24.13 v34.92,24.13 | PORT1.7 19.05,10.16 21.27,10.16 21.59,10.48 v21.59,10.79
  Bottom 0.305: v21.59,10.79 21.59,12.7 20.95,13.34 20.95,23.81 20.64,24.13 v18.41,24.13 | v34.92,24.13 34.92,25.4 34.92,25.72 34.92,35.88 35.24,36.2 54.29,36.2 54.61,35.88 VALVE_REGISTER.19
PORT_2_A_IN
  Top 0.305: PORT2.8 36.2,14.61 36.8,15.21 48.87,15.21 49.53,15.88 DUE_ANALOG.2
PORT_2_D_IN  (via drill 0.35)
  Top 0.305: v62.23,37.47 v59.69,37.47
  Bottom 0.305: PORT2.1 27.3,10.48 26.67,11.11 26.67,22.54 26.99,22.86 33.34,22.86 33.66,23.18 33.66,37.15 33.97,37.47 v59.69,37.47 | 5V_3V3_2.5 70.17,47.62 69.85,47.31 69.85,44.77 69.53,44.45 67.31,44.45 66.99,44.13 66.99,37.78 66.67,37.47 v62.23,37.47
PORT_2_D_IN_3.3V
  Top 0.305: 5V_3V3_2.4 77.15,50.16 77.47,50.48 77.47,51.12 77.79,51.44 82.23,51.44 82.55,51.75 82.55,52.7 82.87,53.02 90.11,53.02 DUE_DIGITAL4.11
PORT_2_LED
  Bottom 0.305: DUE_DIGITAL1.8 37.78,65.72 37.78,58.74 37.47,58.42 28.26,58.42 27.94,58.1 27.94,26.99 27.62,26.67 23.81,26.67 23.5,26.35 23.5,8.26 23.81,7.94 29.53,7.94 29.84,8.26 PORT2.3
PORT_2_VALVE  (via drill 0.35)
  Top 0.305: PORT2.7 38.61,9.4 38.73,9.53 v38.73,10.16
  Bottom 0.305: v38.73,10.16 38.73,15.56 39.36,16.18 42.47,16.18 43.26,16.97 43.26,18.08 42.55,18.8 42.55,24.13 42.86,24.45 49.21,24.45 49.53,24.77 49.53,31.43 49.85,31.75 51.75,31.75 52.07,32.07 VALVE_REGISTER.20
PORT_3_A_IN
  Top 0.305: DUE_ANALOG.3 52.07,12.57 PORT3.8
PORT_3_D_IN
  Bottom 0.305: 5V_3V3_2.7 68.9,42.55 68.58,42.23 68.58,36.51 68.26,36.2 63.82,36.2 63.5,35.88 63.5,28.89 63.18,28.57 53.66,28.57 53.34,28.26 53.34,21.27 53.02,20.95 45.88,20.95 45.56,20.64 45.56,14.61 45.24,14.29 43.18,14.29 42.55,13.65 42.55,9.53 42.67,9.4 PORT3.1
PORT_3_D_IN_3.3V
  Top 0.305: 5V_3V3_2.6 77.15,45.09 77.47,45.4 77.47,48.58 77.79,48.9 83.5,48.9 83.82,49.21 83.82,50.16 84.2,50.55 DUE_DIGITAL4.13
PORT_3_LED  (via drill 0.35)
  Top 0.305: PORT3.3 v46.35,7.2 | v37.56,7.62 v36.1,7.62 | v22.54,13.02 v25.4,13.02
  Bottom 0.305: DUE_DIGITAL2.1 41.91,56.2 41.59,55.88 30.8,55.88 30.48,55.56 30.48,24.45 30.16,24.13 25.72,24.13 25.4,23.81 v25.4,13.02 | v46.35,7.2 43.68,7.2 43.48,7.4 42.88,7.4 42.7,7.23 39.76,7.23 39.37,7.62 v37.56,7.62 | v22.54,13.02 22.54,7.62 22.86,7.3 34.92,7.3 35.24,7.62 v36.1,7.62
PORT_3_VALVE
  Bottom 0.305: PORT3.7 51.44,8.26 51.12,7.94 43.74,7.94 43.72,7.96 42.65,7.96 42.62,7.94 41.91,7.94 41.59,8.26 41.59,13.97 42.55,14.92 43.97,14.92 44.29,15.24 44.29,22.54 44.61,22.86 51.75,22.86 52.07,23.18 VALVE_REGISTER.1
PORT_4_A_IN
  Top 0.305: DUE_ANALOG.4 54.61,15.24 54.93,14.92 68.9,14.92 69.22,14.61 PORT4.8
PORT_4_D_IN  (via drill 0.35)
  Top 0.305: v68.58,22.86 v68.58,24.77
  Bottom 0.305: PORT4.1 59.18,9.4 59.05,9.53 59.05,14.92 59.37,15.24 68.26,15.24 68.58,15.56 v68.58,22.86 | 5V_3V3_2.9 77.79,40.01 77.47,39.69 77.47,28.89 77.15,28.57 68.9,28.57 68.58,28.26 v68.58,24.77
PORT_4_D_IN_3.3V
  Top 0.305: 5V_3V3_2.10 88.58,42.55 88.9,42.86 88.9,43.81 89.22,44.13 91.12,44.13 91.44,44.45 91.44,46.35 91.11,46.69 90.47,46.69 90.17,46.99 DUE_DIGITAL4.15
PORT_4_LED  (via drill 0.35)
  Top 0.305: v43.18,6.67 45.85,6.67 46.05,6.47 46.66,6.47 46.86,6.67 v54.61,6.67 | v38.1,6.67 v35.56,6.67 | v21.59,8.89 v24.45,8.89
  Bottom 0.305: PORT4.3 62.87,6.99 62.55,6.67 v54.61,6.67 | v43.18,6.67 v38.1,6.67 | DUE_DIGITAL2.2 44.45,67.31 44.13,67.63 40.64,67.63 40.32,67.31 40.32,64.14 40.64,63.82 40.64,57.47 40.32,57.15 29.53,57.15 29.21,56.83 29.21,25.72 28.89,25.4 24.77,25.4 24.45,25.08 v24.45,8.89 | v21.59,8.89 21.59,6.99 21.91,6.67 v35.56,6.67
PORT_4_VALVE  (via drill 0.35)
  Top 0.305: PORT4.7 70.99,9.4 71.12,9.53 v71.12,10.16
  Bottom 0.305: VALVE_REGISTER.2 54.61,24.13 54.93,23.81 71.12,23.81 71.75,23.18 71.75,13.65 71.12,13.02 v71.12,10.16
PORT_5_A_IN
  Top 0.305: PORT5.8 85.72,15.24 85.41,15.56 67.9,15.56 67.84,15.5 59.59,15.5 59.53,15.56 57.47,15.56 57.15,15.88 DUE_ANALOG.5
PORT_5_D_IN
  Bottom 0.305: PORT5.1 75.69,9.4 75.56,9.53 75.56,14.92 75.88,15.24 82.23,15.24 82.55,15.56 82.55,44.77 82.23,45.09 5V_3V3_2.11
PORT_5_D_IN_3.3V
  Top 0.305: 5V_3V3_2.12 88.58,47.62 88.9,47.31 88.9,45.72 89.15,45.47 DUE_DIGITAL4.17
PORT_5_LED  (via drill 0.33 pad 0.61, 0.35)
  Top 0.305: v76.2,48.26 76.2,48.58 75.88,48.9 66.36,48.9 66.04,49.21 66.04,51.12 65.72,51.44 53.66,51.44 53.34,51.75 v53.34,59.69
  Bottom 0.305: v76.2,48.26 76.2,41.59 76.52,41.27 80.96,41.27 81.28,40.96 81.28,16.83 80.96,16.51 74.61,16.51 74.3,16.19 74.3,8.26 74.61,7.94 79.06,7.94 79.38,8.26 PORT5.3 | DUE_DIGITAL2.3 46.99,63.82 47.31,63.5 53.02,63.5 53.34,63.18 v53.34,59.69
PORT_5_VALVE
  Bottom 0.305: PORT5.7 84.45,7.62 84.14,7.3 73.34,7.3 73.03,7.62 73.03,23.81 72.39,24.45 VALVE_REGISTER.9
PORT_6_A_IN
  Top 0.305: DUE_ANALOG.6 59.69,16.19 59.82,16.06 67.61,16.06 67.75,16.19 101.92,16.19 102.23,15.88 PORT6.8
PORT_6_D_IN
  Bottom 0.305: PORT6.1 92.2,9.4 92.08,9.53 92.08,18.73 91.76,19.05 86.04,19.05 85.72,19.37 85.72,52.39 85.41,52.7 5V_3V3_2.14
PORT_6_D_IN_3.3V
  Bottom 0.305: DUE_DIGITAL4.19 88.2,42.93 87.95,43.18 87.95,54.93 87.63,55.24 5V_3V3_2.15
PORT_6_LED  (via drill 0.35)
  Top 0.305: v76.2,53.98 66.36,53.98 66.04,53.66 66.04,53.02 65.72,52.7 54.93,52.7 54.61,53.02 v54.61,59.69
  Bottom 0.305: PORT6.3 95.89,8.26 95.57,7.94 91.12,7.94 90.81,8.26 90.81,17.46 90.49,17.78 84.14,17.78 83.82,18.1 83.82,51.12 83.5,51.44 76.52,51.44 76.2,51.75 v76.2,53.98 | v54.61,59.69 54.61,63.82 54.29,64.14 49.85,64.14 49.53,64.45 DUE_DIGITAL2.4
PORT_6_VALVE  (via drill 0.35)
  Top 0.305: VALVE_REGISTER.10 74.93,18.73 75.25,18.41 v104.78,18.41 | PORT6.7 104.65,9.4 104.78,9.53 v104.78,10.16
  Bottom 0.305: v104.78,10.16 v104.78,18.41
PORT_7_A_IN  (via drill 0.35)
  Top 0.305: v67.31,16.79 118.46,16.79 118.75,16.51 PORT7.8
  Bottom 0.305: DUE_ANALOG.7 62.23,19.05 62.55,19.37 66.99,19.37 67.31,19.05 v67.31,16.79
PORT_7_D_IN
  Bottom 0.305: 5V_3V3_1.7 102.23,49.53 102.87,48.9 102.87,21.91 103.19,21.59 108.27,21.59 108.58,21.27 108.58,9.53 108.71,9.4 PORT7.1
PORT_7_D_IN_3.3V
  Bottom 0.305: DUE_DIGITAL4.21 91.49,41.71 91.49,45.97 92.2,46.69 94.22,46.69 94.57,47.03 94.57,51.39 95.25,52.07 5V_3V3_1.6
PORT_7_LED  (via drill 0.33 pad 0.61, 0.35)
  Top 0.305: v52.39,55.34 52.39,51.12 52.7,50.8 55.56,50.8 55.88,50.48 v55.88,38.42 | v59.05,38.42 70.8,38.42 71.12,38.1 71.12,31.75 71.44,31.43 71.44,29.21 71.75,28.89 75.88,28.89 76.2,28.57 76.2,20.64 76.52,20.32 85.41,20.32 85.72,20 85.72,19.68 86.04,19.37 99.69,19.37 100.33,20 v103.5,20 | DUE_DIGITAL2.5 52.07,62.23 v52.39,61.91
  Bottom 0.305: PORT7.3 112.39,8.26 112.08,7.94 107.63,7.94 107.31,8.26 107.31,19.68 107,20 v103.5,20 | v52.39,61.91 v52.39,55.34 | v59.05,38.42 v55.88,38.42
PORT_7_VALVE  (via drill 0.35)
  Top 0.305: PORT7.7 121.16,9.4 121.28,9.53 v121.28,10.16 | VALVE_REGISTER.11 74.93,32.07 75.25,31.75 79.69,31.75 80.01,31.43 80.01,24.45 80.33,24.13 87.95,24.13 88.27,23.81 88.27,21.59 88.58,21.27 97.47,21.27 97.79,21.59 97.79,23.81 98.11,24.13 120.97,24.13 121.28,23.81 v121.28,16.19
  Bottom 0.305: v121.28,10.16 v121.28,16.19
PORT_8_A_IN
  Top 0.305: PORT8.8 135.51,14.99 135.25,15.24 120.33,15.24 120.02,15.56 120.02,17.14 119.81,17.35 67.79,17.35 67.61,17.53 DUE_ANALOG.8
PORT_8_D_IN
  Bottom 0.305: PORT8.1 125.22,9.4 125.09,9.53 125.09,18.1 124.78,18.41 111.44,18.41 111.12,18.73 111.12,23.81 110.81,24.13 106.05,24.13 105.73,24.45 105.73,46.67 106.05,46.99 5V_3V3_1.9
PORT_8_D_IN_3.3V
  Bottom 0.305: 5V_3V3_1.10 105.41,49.53 104.14,50.8 96.52,50.8 95.89,50.16 95.89,45.72 95.25,45.09 94.3,45.09 93.98,44.77 93.98,39.37 93.66,39.05 91.38,39.05 DUE_DIGITAL4.23
PORT_8_LED  (via drill 0.35)
  Top 0.305: v87.81,57.88 87.59,58.1 v83.82,58.1
  Bottom 0.305: PORT8.3 129.16,8.19 128.91,7.94 124.14,7.94 123.83,8.26 123.83,16.83 123.51,17.14 110.17,17.14 109.86,17.46 109.86,22.54 109.54,22.86 104.46,22.86 104.14,23.18 104.14,47.94 104.46,48.26 108.9,48.26 109.22,48.58 109.22,53.02 108.9,53.34 98.11,53.34 97.79,53.66 97.79,54.29 97.47,54.61 93.35,54.61 93.19,54.46 89.05,54.46 88.9,54.61 88.9,57.47 88.58,57.78 87.91,57.78 v87.81,57.88 | DUE_DIGITAL2.6 54.61,65.09 54.93,64.77 55.56,64.77 55.88,64.45 55.88,58.74 56.2,58.42 64.14,58.42 64.45,58.1 64.45,56.83 64.77,56.52 73.66,56.52 73.98,56.83 73.98,59.69 74.3,60.01 81.92,60.01 82.23,59.69 82.23,58.42 82.55,58.1 v83.82,58.1
PORT_8_VALVE  (via drill 0.35)
  Top 0.305: PORT8.7 137.03,9.4 137.16,9.53 137.16,16.19 136.84,16.51 123.51,16.51 123.19,16.83 v123.19,20.32 | VALVE_REGISTER.12 72.39,30.8 72.71,30.48 77.79,30.48 78.11,30.16 78.11,22.54 78.42,22.23 86.68,22.23 87,21.91 87,20.64 87.31,20.32 98.74,20.32 99.06,20.64 99.06,21.91 99.38,22.23 119.06,22.23 119.38,21.91 v119.38,20.32
  Bottom 0.305: v119.38,20.32 v123.19,20.32
QA
  Top 0.305: SYNC.2 133.99,68.58 133.32,67.92 130.15,67.92 129.54,67.31 129.54,63.5 128.27,62.23 SYNC_REGISTER.15
QB
  Top 0.305: SYNC.3 132.72,74.3 133.03,74.61 137.48,74.61 137.79,74.3 137.79,68.58 137.48,68.26 135.57,68.26 135.25,67.94 135.25,64.77 134.94,64.45 131.13,64.45 130.81,64.77 SYNC_REGISTER.1
QC
  Top 0.305: SYNC.4 131.44,69.22 130.81,68.58 129.54,68.58 128.27,67.31 SYNC_REGISTER.2
QD
  Top 0.305: SYNC.5 130.18,74.61 129.86,74.93 123.51,74.93 123.19,74.61 123.19,70.8 122.87,70.48 119.7,70.48 119.38,70.17 119.38,64.45 119.7,64.14 125.41,64.14 125.73,64.45 SYNC_REGISTER.3
QE
  Top 0.305: SYNC.6 128.91,69.22 127.64,67.94 123.83,67.94 123.19,67.31 SYNC_REGISTER.4
QF
  Top 0.305: SYNC.7 124.71,72.64 124.46,72.39 124.46,69.53 124.14,69.22 120.97,69.22 120.65,68.9 SYNC_REGISTER.5
QG
  Bottom 0.305: SYNC.8 126.11,69.85 118.43,69.85 118.11,69.53 SYNC_REGISTER.6
SERIAL_1_RX
  Bottom 0.305: SERIAL1.4 112.9,68.45 112.39,67.94 104.78,67.94 103.82,66.67 103.82,59.69 103.19,59.05 101.6,59.05 100.97,59.69 5V_3V3_1.3
SERIAL_2_RX  (via drill 0.35)
  Top 0.305: v102.23,56.78 v102.23,60.01
  Bottom 0.305: 5V_3V3_1.5 101.6,54.61 102.23,55.24 v102.23,56.78 | v102.23,60.01 102.23,65.41 101.6,66.04 94.61,66.04 93.6,67.06 SERIAL2.4
SHIFT_RCLK
  Top 0.305: DUE_DIGITAL4.4 97.54,63.25 97.79,63.5 120.33,63.5 120.65,63.18 SYNC_REGISTER.12
SPI_CLK  (via drill 0.35)
  Top 0.406: v69.85,51.44 73.34,51.44 73.66,51.75 73.66,52.39 73.98,52.7 77.15,52.7 77.47,53.02 77.47,53.66 77.79,53.98 82.23,53.98 82.55,54.29 89.65,54.29 89.67,54.3 90.67,54.3 90.69,54.29 91.12,54.29 91.44,54.61 91.44,56.52 91.77,56.84 93.67,56.84 93.98,57.15 93.98,58.74 94.3,59.05 94.63,59.05 94.66,59.08 97.18,59.08 97.47,59.37 97.47,60.64 97.79,60.96 117.79,60.96 118.11,60.64 SYNC_REGISTER.11 | ICSP.3 58.17,42.93 57.78,42.55 57.78,35.88 58.1,35.56 60.64,35.56 60.96,35.24 60.96,29.84 61.28,29.53 69.53,29.53 69.85,29.21 VALVE_REGISTER.8
  Bottom 0.406: ICSP.3 58.04,42.93 57.78,43.18 57.78,46.67 58.1,46.99 66.99,46.99 67.31,47.31 67.31,51.12 67.63,51.44 v69.85,51.44
SPI_DATA  (via drill 0.35)
  Top 0.406: v113.03,39.69 103.82,39.69 103.5,40.01 103.5,43.5 103.19,43.81 93.55,43.81 93.22,44.15 92.2,44.15 91.49,43.43 91.49,41.96 91.14,41.6 89.67,41.6 89.33,41.27 66.04,41.27 64.39,42.93 ICSP.4
  Bottom 0.406: SYNC_REGISTER.14 125.73,56.52 124.46,55.24 124.46,40.01 124.14,39.69 v113.03,39.69 | ICSP.4 64.39,42.93 64.77,42.55 64.77,39.05 64.45,38.73 61.28,38.73 60.96,38.42 60.96,35.88 60.64,35.56 57.47,35.56 57.15,35.24 VALVE_REGISTER.18
TERMINAL_IN_1
  Top 0.406: 5V_3V3_3.9 113.03,47.62 113.67,48.26 133.99,48.26 134.62,47.62 134.62,46.35 135.55,45.43 SPRINGTERMINAL.P$16
TERMINAL_IN_1_3.3
  Top 0.305: 5V_3V3_3.10 115.57,44.13 115.25,43.81 110.81,43.81 110.49,44.13 110.49,47.94 110.17,48.26 92.96,48.26 DUE_DIGITAL4.16
TERMINAL_IN_2
  Top 0.406: 5V_3V3_3.7 115.57,50.8 116.26,50.11 136.85,50.11 SPRINGTERMINAL.P$17
TERMINAL_IN_2_3.3  (via drill 0.35)
  Top 0.305: DUE_DIGITAL4.14 96.9,50.55 97.16,50.8 97.16,53.02 97.47,53.34 109.22,53.34 109.54,53.02 109.54,49.85 109.86,49.53 v111.76,49.53
  Bottom 0.305: v111.76,49.53 112.71,49.53 113.03,49.85 113.03,51.12 113.35,51.44 117.79,51.44 118.11,51.75 5V_3V3_3.6
TERMINAL_IN_3
  Top 0.406: 5V_3V3_3.5 120.65,51.44 121.31,50.77 133.96,50.77 134.65,51.46 134.65,54.63 135.44,55.43 SPRINGTERMINAL.P$18
TERMINAL_IN_3_3.3  (via drill 0.35)
  Top 0.305: DUE_DIGITAL4.12 95.63,53.09 95.89,53.34 95.89,55.56 96.2,55.88 110.17,55.88 110.49,55.56 110.49,54.61 111.12,53.98 111.12,51.75 111.44,51.44 113.98,51.44 114.3,51.12 v114.3,50.16
  Bottom 0.305: 5V_3V3_3.4 123.19,50.48 122.87,50.16 v114.3,50.16
TERMINAL_IN_4
  Top 0.406: 5V_3V3_3.3 125.73,52.07 126.36,51.44 133.35,51.44 133.99,52.07 133.99,59.69 134.72,60.43 SPRINGTERMINAL.P$19
TERMINAL_IN_4_3.3  (via drill 0.35)
  Top 0.305: v125.73,49.33 v123.19,49.33 | DUE_DIGITAL4.10 94.36,55.63 94.64,55.91 94.64,58.13 94.93,58.42 v97.79,58.42
  Bottom 0.305: v125.73,49.33 128.07,49.33 128.27,49.53 5V_3V3_3.2 | v97.79,58.42 100.97,58.42 101.6,57.78 103.19,57.78 103.82,58.42 109.22,58.42 109.86,57.78 109.86,49.53 110.64,48.74 123.04,48.74 123.19,48.9 v123.19,49.33
TERMINAL_OUT_1
  Top 0.406: DUE_DIGITAL4.24 94.23,37.85 94.61,37.47 94.61,33.66 95.25,33.02 127.32,33.02 127.64,32.7 127.64,25.72 127.95,25.4 137.13,25.4 SPRINGTERMINAL.P$12
TERMINAL_OUT_2
  Top 0.406: SPRINGTERMINAL.P$13 137.11,30.48 135.89,30.48 134.62,31.75 130.18,31.75 129.54,32.38 129.54,35.88 128.91,36.51 97.79,36.51 97.16,37.15 97.16,40.01 96.77,40.39 DUE_DIGITAL4.22
TERMINAL_OUT_3
  Top 0.406: SPRINGTERMINAL.P$14 137.16,36.2 136.53,36.83 131.44,36.83 130.18,38.1 99.38,38.1 99.06,38.42 99.06,42.55 98.68,42.93 DUE_DIGITAL4.20
TERMINAL_OUT_4
  Top 0.406: DUE_DIGITAL4.18 105.66,45.47 106.05,45.09 106.05,41.59 106.36,41.27 135.57,41.27 136.42,40.43 SPRINGTERMINAL.P$15
VALVE_SHIFT_RCK
  Bottom 0.305: DUE_DIGITAL4.3 88.01,63.25 87.63,62.87 87.63,58.74 87.31,58.42 85.41,58.42 85.09,58.1 85.09,56.83 84.77,56.52 75.25,56.52 74.93,56.2 74.93,37.15 74.61,36.83 73.98,36.83 73.66,36.51 73.66,30.16 73.34,29.84 67.63,29.84 67.31,29.53 VALVE_REGISTER.7
VCC  (via drill 0.35)
  Top 0.305: PORT8.2 124.65,11.94 124.46,11.75 124.46,5.71 | PORT7.2 108.14,11.94 107.95,11.75 107.95,5.71 | PORT6.2 91.63,11.94 91.44,11.75 91.44,5.71 | PORT5.2 75.12,11.94 74.93,11.75 74.93,5.71 | PORT4.2 58.61,11.94 58.42,11.75 58.42,5.71 | PORT3.2 42.1,11.94 41.91,11.75 41.91,5.71
  Top 0.61: 5V_3V3_3.1 C3.1 132.08,55.88 132.72,56.52 v132.72,62.87 139.06,62.87 139.7,62.23 139.7,16.51 140.34,15.88 v141.6,15.88 | v109.86,64.77 109.86,67.63 109.54,67.94 C1.1 99.69,67.94 | v141.6,8.89 139.7,8.89 139.7,6.35 139.06,5.71 124.46,5.71 107.95,5.71 91.44,5.71 74.93,5.71 58.42,5.71 41.91,5.71 25.4,5.71 | PORT2.2 25.59,11.94 25.4,11.75 25.4,5.71 | PORT1.2 11.94,12.06 9.21,12.06 8.89,11.75 8.89,6.03 v9.21,5.71 25.4,5.71 | v85.72,66.04 85.72,67.63 86.04,67.94 99.69,67.94 | 5V_3V3_1.1 99.69,67.94
  Bottom 0.61: PORT2.2 28.57,15.24 29.21,15.88 31.11,15.88 31.75,16.51 DUE_PWR.2 | Q3.G 65.41,59.69 67.31,57.78 C2.1 5V_3V3_2.1 71.75,60.64 72.07,60.96 82.55,60.96 83.82,59.69 Q4.G 85.09,64.14 85.72,64.77 v85.72,66.04 | v109.86,64.77 109.86,63.5 110.49,62.87 v132.72,62.87 | v141.6,15.88 v141.6,8.89 | v9.21,5.71 6.35,5.71 6.03,6.03 6.03,30.16 6.35,30.48 25.08,30.48 25.4,30.8 25.4,40.96 25.08,41.27 16.83,41.27 16.51,41.59 OPTOCOUPLER.8 C6.1

### Text on the board
tPlace: S/N: | Input Ch2 | Input Ch1 | Output Ch2 | Output Ch1 | Serial 2 | Serial 1 | State SYNC | Status / LED | Bpod r0.5.1 | Spring terminal | Open source animal behavior measurement & control | Port 1 | Port 2 | Port 3 | Port 4 | Port 5 | Port 6 | Port 7 | Port 8